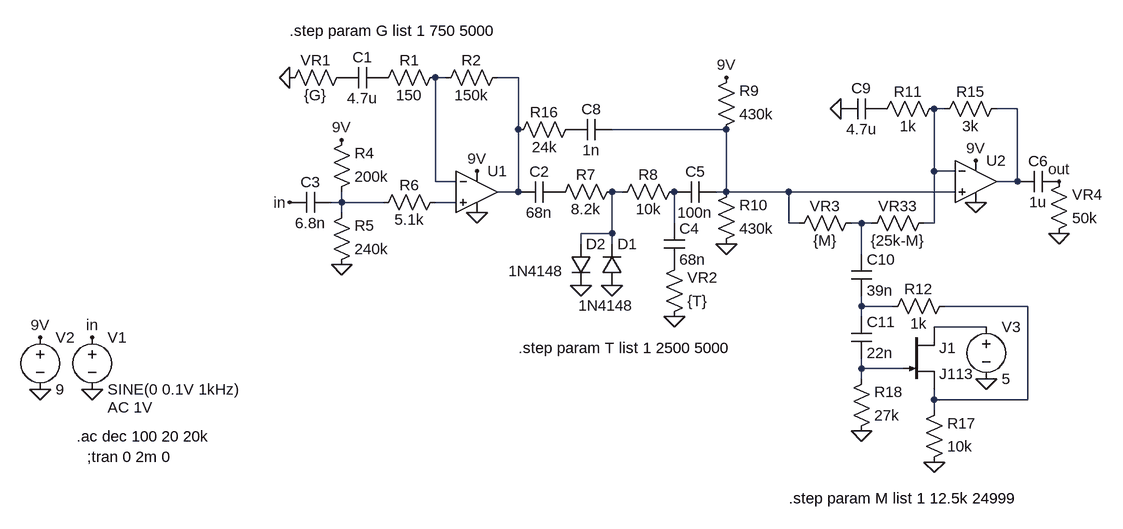
[diagram p0: schematic AnodizedBrownDist4K.asc]
AnodizedBrownDist4K.asc, the LTspice schematic file:
Version 4
SHEET 1 3148 2740
WIRE -1504 912 -1520 912
WIRE -1392 912 -1424 912
WIRE -736 960 -752 960
WIRE -624 960 -656 960
WIRE -1392 992 -1392 912
WIRE -1072 992 -1248 992
WIRE -752 1056 -752 960
WIRE -720 1056 -752 1056
WIRE -1520 1072 -1520 912
WIRE -1488 1072 -1520 1072
WIRE -624 1072 -624 960
WIRE -624 1072 -656 1072
WIRE -1392 1088 -1392 992
WIRE -1392 1088 -1424 1088
WIRE -1232 1088 -1248 1088
WIRE -1072 1088 -1072 992
WIRE -1072 1088 -1088 1088
WIRE -976 1088 -1072 1088
WIRE -720 1088 -976 1088
WIRE -1664 1104 -1664 1088
WIRE -1664 1104 -1680 1104
WIRE -1600 1104 -1664 1104
WIRE -1488 1104 -1520 1104
WIRE -1664 1120 -1664 1104
WIRE -1152 1136 -1152 1088
WIRE -976 1136 -976 1088
WIRE -960 1136 -976 1136
WIRE -864 1136 -880 1136
WIRE -848 1136 -864 1136
WIRE -752 1136 -752 1056
WIRE -752 1136 -768 1136
WIRE -1248 1152 -1248 1088
WIRE -1248 1152 -1296 1152
WIRE -1296 1168 -1296 1152
WIRE -1248 1168 -1248 1152
WIRE -864 1184 -864 1136
WIRE -864 1264 -864 1248
WIRE -816 1264 -864 1264
WIRE -608 1264 -736 1264
WIRE -864 1280 -864 1264
WIRE -672 1296 -752 1296
WIRE -864 1360 -864 1344
WIRE -800 1360 -864 1360
WIRE -864 1376 -864 1360
WIRE -752 1408 -752 1392
WIRE -608 1408 -608 1264
WIRE -608 1408 -752 1408
WIRE -752 1424 -752 1408
FLAG -2048 1392 0
FLAG -2048 1312 in
FLAG -2128 1392 0
FLAG -2128 1312 9V
FLAG -1744 1104 in
FLAG -1664 1008 9V
FLAG -1664 1200 0
FLAG -1456 1120 0
FLAG -1456 1056 9V
FLAG -1744 912 0
FLAG -1248 1232 0
FLAG -1296 1232 0
FLAG -1152 1280 0
FLAG -1072 1168 0
FLAG -1072 912 9V
FLAG -864 1456 0
FLAG -752 1504 0
FLAG -672 1376 0
FLAG -688 1104 0
FLAG -688 1040 9V
FLAG -896 960 0
FLAG -560 1152 0
FLAG -560 1072 out
SYMBOL voltage -2048 1296 R0
WINDOW 123 24 124 Left 2
WINDOW 39 0 0 Left 2
SYMATTR Value2 AC 1V
SYMATTR InstName V1
SYMATTR Value SINE(0 0.1V 1kHz)
SYMBOL voltage -2128 1296 R0
WINDOW 123 0 0 Left 0
WINDOW 39 0 0 Left 0
SYMATTR InstName V2
SYMATTR Value 9
SYMBOL cap -1680 1088 R90
WINDOW 0 0 32 VBottom 2
WINDOW 3 32 32 VTop 2
SYMATTR InstName C3
SYMATTR Value 6.8n
SYMBOL res -1680 1104 M180
WINDOW 0 36 76 Left 2
WINDOW 3 36 40 Left 2
SYMATTR InstName R4
SYMATTR Value 200k
SYMBOL res -1680 1216 M180
WINDOW 0 36 76 Left 2
WINDOW 3 36 40 Left 2
SYMATTR InstName R5
SYMATTR Value 240k
SYMBOL res -1504 1088 R90
WINDOW 0 5 56 VBottom 2
WINDOW 3 27 56 VTop 2
SYMATTR InstName R6
SYMATTR Value 5.1k
SYMBOL res -1408 896 R90
WINDOW 0 5 56 VBottom 2
WINDOW 3 27 56 VTop 2
SYMATTR InstName R2
SYMATTR Value 150k
SYMBOL res -1504 896 R90
WINDOW 0 5 56 VBottom 2
WINDOW 3 27 56 VTop 2
SYMATTR InstName R1
SYMATTR Value 150
SYMBOL cap -1600 896 R90
WINDOW 0 0 32 VBottom 2
WINDOW 3 32 32 VTop 2
SYMATTR InstName C1
SYMATTR Value 4.7u
SYMBOL res -1648 896 R90
WINDOW 0 5 56 VBottom 2
WINDOW 3 27 56 VTop 2
SYMATTR InstName VR1
SYMATTR Value {G}
SYMBOL cap -1328 1072 R90
WINDOW 0 0 32 VBottom 2
WINDOW 3 32 32 VTop 2
SYMATTR InstName C2
SYMATTR Value 68n
SYMBOL res -1296 976 R90
WINDOW 0 5 56 VBottom 2
WINDOW 3 27 56 VTop 2
SYMATTR InstName R16
SYMATTR Value 24k
SYMBOL cap -1248 976 R90
WINDOW 0 0 32 VBottom 2
WINDOW 3 32 32 VTop 2
SYMATTR InstName C8
SYMATTR Value 1n
SYMBOL res -1232 1072 R90
WINDOW 0 5 56 VBottom 2
WINDOW 3 27 56 VTop 2
SYMATTR InstName R7
SYMATTR Value 8.2k
SYMBOL diode -1312 1168 R0
WINDOW 3 -95 42 Left 2
SYMATTR Value 1N4148
SYMATTR InstName D2
SYMBOL diode -1264 1232 M180
WINDOW 0 24 64 Left 2
WINDOW 3 -36 -31 Left 2
SYMATTR InstName D1
SYMATTR Value 1N4148
SYMBOL res -1136 1072 R90
WINDOW 0 5 56 VBottom 2
WINDOW 3 27 56 VTop 2
SYMATTR InstName R8
SYMATTR Value 10k
SYMBOL cap -1168 1136 R0
SYMATTR InstName C4
SYMATTR Value 68n
SYMBOL res -1168 1296 M180
WINDOW 0 36 76 Left 2
WINDOW 3 36 40 Left 2
SYMATTR InstName VR2
SYMATTR Value {T}
SYMBOL res -1088 1184 M180
WINDOW 0 36 76 Left 2
WINDOW 3 36 40 Left 2
SYMATTR InstName R10
SYMATTR Value 430k
SYMBOL res -1088 1008 M180
WINDOW 0 36 76 Left 2
WINDOW 3 36 40 Left 2
SYMATTR InstName R9
SYMATTR Value 430k
SYMBOL cap -1088 1072 R90
WINDOW 0 0 32 VBottom 2
WINDOW 3 32 32 VTop 2
SYMATTR InstName C5
SYMATTR Value 100n
SYMBOL njf -800 1296 R0
SYMATTR InstName J1
SYMATTR Value J113
SYMBOL res -864 1120 R90
WINDOW 0 5 56 VBottom 2
WINDOW 3 27 56 VTop 2
SYMATTR InstName VR3
SYMATTR Value {M}
SYMBOL res -752 1120 R90
WINDOW 0 5 56 VBottom 2
WINDOW 3 27 56 VTop 2
SYMATTR InstName VR33
SYMATTR Value {25k-M}
SYMBOL cap -880 1184 R0
SYMATTR InstName C10
SYMATTR Value 39n
SYMBOL cap -880 1280 R0
SYMATTR InstName C11
SYMATTR Value 22n
SYMBOL res -880 1472 M180
WINDOW 0 36 76 Left 2
WINDOW 3 36 40 Left 2
SYMATTR InstName R18
SYMATTR Value 27k
SYMBOL res -768 1520 M180
WINDOW 0 36 76 Left 2
WINDOW 3 36 40 Left 2
SYMATTR InstName R17
SYMATTR Value 10k
SYMBOL voltage -672 1280 R0
WINDOW 123 0 0 Left 0
WINDOW 39 0 0 Left 0
SYMATTR InstName V3
SYMATTR Value 5
SYMBOL res -640 944 R90
WINDOW 0 5 56 VBottom 2
WINDOW 3 27 56 VTop 2
SYMATTR InstName R15
SYMATTR Value 3k
SYMBOL res -736 944 R90
WINDOW 0 5 56 VBottom 2
WINDOW 3 27 56 VTop 2
SYMATTR InstName R11
SYMATTR Value 1k
SYMBOL cap -832 944 R90
WINDOW 0 0 32 VBottom 2
WINDOW 3 32 32 VTop 2
SYMATTR InstName C9
SYMATTR Value 4.7u
SYMBOL cap -560 1056 R90
WINDOW 0 0 32 VBottom 2
WINDOW 3 32 32 VTop 2
SYMATTR InstName C6
SYMATTR Value 1u
SYMBOL res -576 1168 M180
WINDOW 0 36 76 Left 2
WINDOW 3 36 40 Left 2
SYMATTR InstName VR4
SYMATTR Value 50k
SYMBOL res -720 1248 R90
WINDOW 0 5 56 VBottom 2
WINDOW 3 27 56 VTop 2
SYMATTR InstName R12
SYMATTR Value 1k
SYMBOL Opamps\\UniversalOpamp2 -1456 1088 R0
SYMATTR InstName U1
SYMBOL Opamps\\UniversalOpamp2 -688 1072 R0
SYMATTR InstName U2
TEXT -2072 1464 Left 2 !.ac dec 100 20 20k
TEXT -2056 1496 Left 2 !;tran 0 2m 0
TEXT -1744 840 Left 2 !.step param G list 1 750 5000
TEXT -976 1560 Left 2 !.step param M list 1 12.5k 24999
TEXT -1392 1328 Left 2 !.step param T list 1 2500 5000

The netlist it stands for:
* AnodizedBrownDist4K.asc
V1 in 0 SINE(0 0.1V 1kHz) AC 1V
V2 9V 0 9
C3 N007 in 6.8n
R4 N007 9V 200k
R5 0 N007 240k
R6 N008 N007 5.1k
R2 N002 N001 150k
R1 N001 P001 150
C1 P001 P002 4.7u
R§VR1 P002 0 {G}
C2 P003 N002 68n
R16 P004 N002 24k
C8 N005 P004 1n
R7 N006 P003 8.2k
D2 N006 0 1N4148
D1 0 N006 1N4148
R8 N009 N006 10k
C4 N009 P005 68n
R§VR2 0 P005 {T}
R10 0 N005 430k
R9 N005 9V 430k
C5 N005 N009 100n
J1 N013 N014 N012 J113
R§VR3 N010 N005 {M}
R§VR33 N003 N010 {25k-M}
C10 N010 N011 39n
C11 N011 N014 22n
R18 0 N014 27k
R17 0 N012 10k
V3 N013 0 5
R15 N004 N003 3k
R11 N003 P006 1k
C9 P006 0 4.7u
C6 out N004 1u
R§VR4 0 out 50k
R12 N012 N011 1k
XU1 N008 N001 9V 0 N002 level.2 Avol=1Meg GBW=10Meg Slew=10Meg ilimit=25m rail=0 Vos=0 phimargin=45 en=0 enk=0 in=0 ink=0 Rin=500Meg  ; pins IN+ IN- V+ V- OUT
XU2 N005 N003 9V 0 N004 level.2 Avol=1Meg GBW=10Meg Slew=10Meg ilimit=25m rail=0 Vos=0 phimargin=45 en=0 enk=0 in=0 ink=0 Rin=500Meg  ; pins IN+ IN- V+ V- OUT
.model D D
.lib standard.dio
.model NJF NJF
.model PJF PJF
.lib standard.jft
.ac dec 100 20 20k
;tran 0 2m 0
.step param G list 1 750 5000
.step param M list 1 12.5k 24999
.step param T list 1 2500 5000
.lib UniversalOpamps2.sub
.backanno
.end